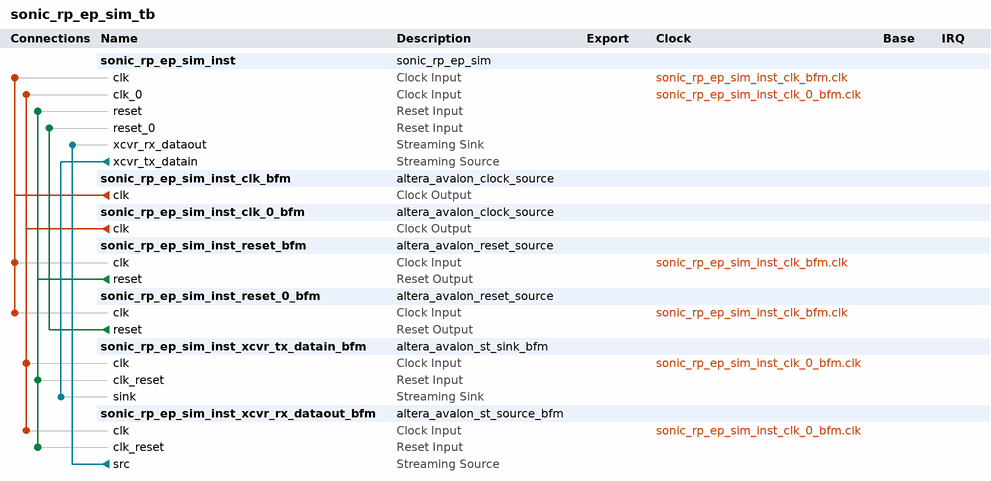
[diagram p0: system contents]
# Platform Designer (Qsys) system sonic_rp_ep_sim_tb
# Parameters at their usual value, and those the tool derives, are not listed.
package require -exact qsys 11.0
create_system sonic_rp_ep_sim_tb
set_project_property DEVICE_FAMILY STRATIXIV

add_instance sonic_rp_ep_sim_inst sonic_rp_ep_sim 1.0

add_instance sonic_rp_ep_sim_inst_clk_bfm altera_avalon_clock_source 11.0
set_instance_parameter_value sonic_rp_ep_sim_inst_clk_bfm CLOCK_RATE 250

add_instance sonic_rp_ep_sim_inst_clk_0_bfm altera_avalon_clock_source 11.0
set_instance_parameter_value sonic_rp_ep_sim_inst_clk_0_bfm CLOCK_RATE 156

add_instance sonic_rp_ep_sim_inst_reset_bfm altera_avalon_reset_source 11.0
set_instance_parameter_value sonic_rp_ep_sim_inst_reset_bfm ASSERT_HIGH_RESET 0
set_instance_parameter_value sonic_rp_ep_sim_inst_reset_bfm INITIAL_RESET_CYCLES 50

add_instance sonic_rp_ep_sim_inst_reset_0_bfm altera_avalon_reset_source 11.0
set_instance_parameter_value sonic_rp_ep_sim_inst_reset_0_bfm ASSERT_HIGH_RESET 0
set_instance_parameter_value sonic_rp_ep_sim_inst_reset_0_bfm INITIAL_RESET_CYCLES 50

add_instance sonic_rp_ep_sim_inst_xcvr_tx_datain_bfm altera_avalon_st_sink_bfm 11.0
set_instance_parameter_value sonic_rp_ep_sim_inst_xcvr_tx_datain_bfm USE_PACKET 0
set_instance_parameter_value sonic_rp_ep_sim_inst_xcvr_tx_datain_bfm USE_CHANNEL 0
set_instance_parameter_value sonic_rp_ep_sim_inst_xcvr_tx_datain_bfm USE_ERROR 0
set_instance_parameter_value sonic_rp_ep_sim_inst_xcvr_tx_datain_bfm USE_READY 0
set_instance_parameter_value sonic_rp_ep_sim_inst_xcvr_tx_datain_bfm USE_VALID 0
set_instance_parameter_value sonic_rp_ep_sim_inst_xcvr_tx_datain_bfm USE_EMPTY 0
set_instance_parameter_value sonic_rp_ep_sim_inst_xcvr_tx_datain_bfm ST_SYMBOL_W 40
set_instance_parameter_value sonic_rp_ep_sim_inst_xcvr_tx_datain_bfm ST_NUMSYMBOLS 1
set_instance_parameter_value sonic_rp_ep_sim_inst_xcvr_tx_datain_bfm ST_CHANNEL_W 1
set_instance_parameter_value sonic_rp_ep_sim_inst_xcvr_tx_datain_bfm ST_ERROR_W 1
set_instance_parameter_value sonic_rp_ep_sim_inst_xcvr_tx_datain_bfm ST_READY_LATENCY 0
set_instance_parameter_value sonic_rp_ep_sim_inst_xcvr_tx_datain_bfm ST_MAX_CHANNELS 0

add_instance sonic_rp_ep_sim_inst_xcvr_rx_dataout_bfm altera_avalon_st_source_bfm 11.0
set_instance_parameter_value sonic_rp_ep_sim_inst_xcvr_rx_dataout_bfm USE_PACKET 0
set_instance_parameter_value sonic_rp_ep_sim_inst_xcvr_rx_dataout_bfm USE_CHANNEL 0
set_instance_parameter_value sonic_rp_ep_sim_inst_xcvr_rx_dataout_bfm USE_ERROR 0
set_instance_parameter_value sonic_rp_ep_sim_inst_xcvr_rx_dataout_bfm USE_READY 0
set_instance_parameter_value sonic_rp_ep_sim_inst_xcvr_rx_dataout_bfm USE_VALID 0
set_instance_parameter_value sonic_rp_ep_sim_inst_xcvr_rx_dataout_bfm USE_EMPTY 0
set_instance_parameter_value sonic_rp_ep_sim_inst_xcvr_rx_dataout_bfm ST_SYMBOL_W 40
set_instance_parameter_value sonic_rp_ep_sim_inst_xcvr_rx_dataout_bfm ST_NUMSYMBOLS 1
set_instance_parameter_value sonic_rp_ep_sim_inst_xcvr_rx_dataout_bfm ST_CHANNEL_W 1
set_instance_parameter_value sonic_rp_ep_sim_inst_xcvr_rx_dataout_bfm ST_ERROR_W 1
set_instance_parameter_value sonic_rp_ep_sim_inst_xcvr_rx_dataout_bfm ST_MAX_CHANNELS 0

# connections
add_connection sonic_rp_ep_sim_inst_clk_0_bfm.clk sonic_rp_ep_sim_inst.clk_0 clock
add_connection sonic_rp_ep_sim_inst_clk_0_bfm.clk sonic_rp_ep_sim_inst_xcvr_rx_dataout_bfm.clk clock
add_connection sonic_rp_ep_sim_inst_clk_0_bfm.clk sonic_rp_ep_sim_inst_xcvr_tx_datain_bfm.clk clock
add_connection sonic_rp_ep_sim_inst_clk_bfm.clk sonic_rp_ep_sim_inst.clk clock
add_connection sonic_rp_ep_sim_inst_clk_bfm.clk sonic_rp_ep_sim_inst_reset_0_bfm.clk clock
add_connection sonic_rp_ep_sim_inst_clk_bfm.clk sonic_rp_ep_sim_inst_reset_bfm.clk clock
add_connection sonic_rp_ep_sim_inst_reset_0_bfm.reset sonic_rp_ep_sim_inst.reset_0 reset
add_connection sonic_rp_ep_sim_inst_reset_bfm.reset sonic_rp_ep_sim_inst.reset reset
add_connection sonic_rp_ep_sim_inst_reset_bfm.reset sonic_rp_ep_sim_inst_xcvr_rx_dataout_bfm.clk_reset reset
add_connection sonic_rp_ep_sim_inst_reset_bfm.reset sonic_rp_ep_sim_inst_xcvr_tx_datain_bfm.clk_reset reset
add_connection sonic_rp_ep_sim_inst.xcvr_tx_datain sonic_rp_ep_sim_inst_xcvr_tx_datain_bfm.sink avalon_streaming
add_connection sonic_rp_ep_sim_inst_xcvr_rx_dataout_bfm.src sonic_rp_ep_sim_inst.xcvr_rx_dataout avalon_streaming

save_system sonic_rp_ep_sim_tb.qsys
